# Altium project AT42QT1010_EVK.PrjPcb
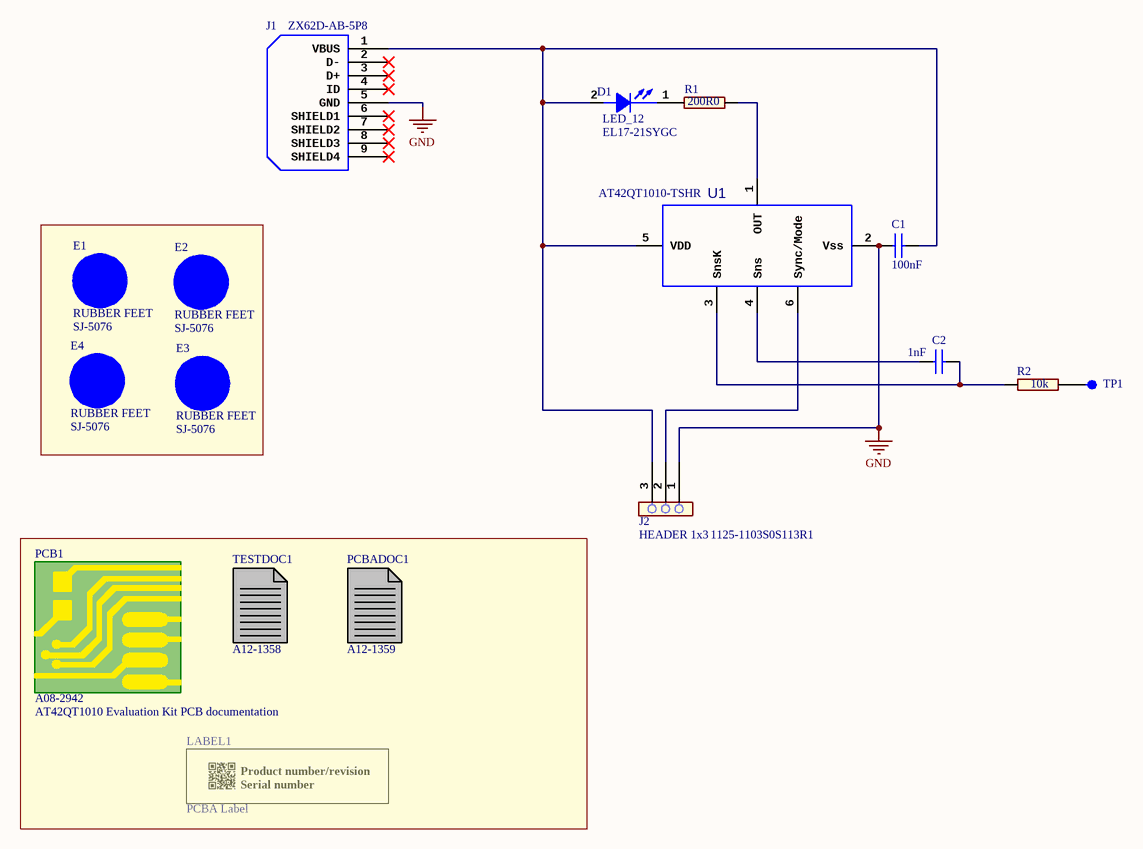
[diagram p0: AT42QT1010_EVK.SchDoc]
1 sheet, 17 parts. Net scope: global (net labels, ports and power ports of the same name join across sheets).
Board file: AT42QT1010_EVK.PcbDoc

## Sheet AT42QT1010_EVK.SchDoc
size A4

### Parts
C1  value 100nF  [AP1-00002]  (hidden comment: CAP-NONPOL)
C2  value 1nF  [AP1-00002]  (hidden comment: CAP-NONPOL)
D1  LED_12  value EL17-21SYGC  [AP4-00013]
E1  RUBBER FEET  value SJ-5076  [AP8-00192]
E2  RUBBER FEET  value SJ-5076  [AP8-00192]
E3  RUBBER FEET  value SJ-5076  [AP8-00192]
E4  RUBBER FEET  value SJ-5076  [AP8-00192]
J1  value ZX62D-AB-5P8  [AP8-00852]  (hidden comment: 2,000 pieces per reel / NOTE! It is recommended to use low-cost version A08-2839 for new designs.)
J2  HEADER 1x3  value 1125-1103S0S113R1  [AP8-01075]
LABEL1  value PCBA Label  [AP8-00317]  (hidden comment: PCBA_LABEL)
PCB1  value AT42QT1010 Evaluation Kit PCB documentation  AN: A08-2942  (hidden comment: PCB)  (mechanical)
PCBADOC1  AN: A12-1359  (hidden comment: PCBADOC)  (mechanical)
R1  value 200R0  [AP2-00001]  (hidden comment: Farnell no: 	2116604)
R2  value 10k  [AP2-00001]  (hidden comment: R2)
TESTDOC1  AN: A12-1358  (hidden comment: TESTDOC)  (mechanical)
TP1  (no value)  [AP8-00010]  (no BOM)
U1  value AT42QT1010-TSHR  [AP6-00056]  (hidden comment: AT42QT1010)

### Nets
GND: C1.1 J1.5(GND) J2.1 U1.2(Vss)
NetC1_2: C1.2 D1.2(ANODE) J1.1(VBUS) J2.3 U1.5(VDD)
NetC2_1: C2.1 U1.4(Sns)
NetC2_2: C2.2 R2.1 U1.3(SnsK)
NetD1_1: D1.1(CATHODE) R1.1
NetJ2_2: J2.2 U1.6(Sync/Mode)
NetR1_2: R1.2 U1.1(OUT)
NetR2_2: R2.2 TP1.1

Not connected (* = marked no-connect by the designer): E1 1(FIDUCIAL); E2 1(FIDUCIAL); E3 1(FIDUCIAL); E4 1(FIDUCIAL); J1 2(D-)* 3(D+)* 4(ID)* 6(SHIELD1)* 7(SHIELD2)* 8(SHIELD3)* 9(SHIELD4)*

### Notes on the sheet
- Drawn By:
- Project Title
- Engineer:
- Designed with
- Sheet Title
- Size
- A4
- PCB Number:
- PCB Assembly Number:
- PCBA Revision:
- PCB    Revision:
- Date:
- Altium.com <http://go.altium.com/MicrochipLandingPage_Evaluation.html>
- File:
- Page:
- (in symbol A09-0611) / Product number/revision / Serial number

### Library data of the parts
C1 = A01-0367: Ceramic capacitor, SMD 0603, X7R, 50V, Â±10 %; PartGroup: Capacitors,Ceramic,SMD 0603; Manufacturer: AVX; MPN: 06035C104KAT2A; ComponentStatus: 'Active (verified)'; Status: Active; Verified by: Lars Helge Mo; Verified date: 2005-12-15; AN: A01-0367; Height: 0.899999976158142; FootprintStatus: 'Active (Verified)'
C2 = A01-0675: Ceramic capacitor, SMD 0603, X7R, 50V, 10 %; PartGroup: Capacitors,Ceramic,SMD 0603; Manufacturer: Multicomp; MPN: MC0603N102J500CT; Tolerance: 10%; TemperatureRange: -55 to +125 deg C; ComponentStatus: 'Active (verified)'; Status: Active; Verified by: Lars Helge Mo; Verified date: 2005-12-15; AN: A01-0675; Height: 0.899999976158142; FootprintStatus: 'Active (Verified)'
D1 = A10-0018: LED, Green, Wave length=575nm, SMD 0805, ±70°; PartGroup: Opto,LEDs,SMD; Manufacturer: Everlight; TemperatureRange: -40 - +85 deg C; ComponentStatus: 'Active (verified)'; Verified date: 2006-02-17; Verified by: Sveinung Helgeland; Status: Active; AN: A10-0018; Height: 1.10000002384186; MPN: EL17-21SYGC; FootprintStatus: 'Active (Verified)'
E1-E4 = A08-0053: 2.8mm adhesive feet,diam 8.0mm; PartGroup: Mechanical devices,Mounting accessories; Manufacturer: 3M; ComponentStatus: 'Active (verified)'; Verified date: 2006-05-05; Verified by: Ketil Skjerve; Status: Active; AN: A08-0053; Height: 2,79999995231628; MPN: SJ-5076; FootprintStatus: 'Active (Verified)'
J1 = A08-2112: Micro USB AB Connector, Standard SMT + DIP; PartGroup: Mechanical devices,Connectors,USB; Manufacturer: HIROSE; MPN: ZX62D-AB-5P8(30); ComponentStatus: 'Active (verified)'; Verified date: 2006-05-18; Verified by: Eirik Rasmussen; Status: Active; AN: A08-2112; Height: 2.79999995231628; FootprintStatus: 'Active (Verified)'
J2 = A08-2783: 1x3 pin header, 2.54mm pitch, Pin-in-Paste THM; PartGroup: Mechanical devices,Connectors,Pin headers; Manufacturer: WCON HARDWARE ELECTRONICS CO., LTD; TemperatureRange: -40Â°C to +105Â°C; ComponentStatus: 'Active (verified)'; Verified date: 2006-01-30; Verified by: Lars Helge Mo; Status: Active; AN: A08-2783; Height: 9; MPN: 1125-1103S0S113R1; FootprintStatus: 'Active (Verified)'
LABEL1 = A09-0611: PCBA identification label PP Top White Gloss; PartGroup: Mechanical devices,Packaging materials,Printed Labels; Manufacturer: ACT Logimark AS; MPN: 505462; ComponentStatus: 'Active (verified)'; Status: New; AN: A09-0611; FootprintStatus: 'Active (Verified)'
PCB1 = A08-2942: AT42QT1010 Evaluation Kit PCB documentation; PartGroup: Mechanical devices,Printed circuit boards; ComponentStatus: 'Active (verified)'
PCBADOC1 = A12-1359: AT42QT1010 Evaluation Kit PCBA documentation; PartGroup: Documentation,PCBA Documents,Atmel; ComponentStatus: 'Active (verified)'; Value: AT42QT1010 Evaluation Kit PCBA documentation
R1 = A02-1114: Thin film resistor, SMD 0603, 166mW, 0.1%, 0603; PartGroup: Resistors,Metal film,SMD Precision resistors; Manufacturer: TE Connectivity; MPN: RP73PF1J200RBTDF; Tolerance: Â±0.1%; TemperatureRange: -55Â°C to +155Â°C; ComponentStatus: 'Active (verified)'; Status: Active; Verified by: Lars Helge Mo; Verified date: 2005-12-19; AN: A02-1114; Height: 0.449999988079071; FootprintStatus: 'Active (Verified)'
R2 = A02-0098: Thick film resistor, SMD 0603, 1/10W, 1%; PartGroup: Resistors,SMD,0603 1%; Manufacturer: KOA; MPN: RK73H1JTTD1002F; ComponentStatus: 'Active (verified)'; Status: Active; Verified by: Lars Helge Mo; Verified date: 2005-12-19; AN: A02-0098; Tolerance: 1 %; Height: 0.5; FootprintStatus: 'Active (Verified)'
TESTDOC1 = A12-1358: AT42QT1010 Evaluation Kit Test Instructions; PartGroup: Documentation,Procedures,Test Instructions; ComponentStatus: 'Active (verified)'; Value: AT42QT1010 Evaluation Kit Test Instructions
TP1 = A08-0004: Single SMD testpad; PartGroup: Mechanical devices,Connectors,Test points; ComponentStatus: 'Active (verified)'; Status: Active; Verified by: Sveinung Helgeland; Verified date: 2006-02-17; AN: A08-0004; Value: TESTPAD; Height: 0; FootprintStatus: 'Active (Verified)'
U1 = A06-0669: 1ch QTouch Sensor IC; PartGroup: Integrated Circuits,Special function,Touch Sense; Manufacturer: ATMEL; ComponentStatus: 'Active (verified)'; Verified date: 2011.05.12; Verified by: vlarsen; Status: Active; AN: A06-0669; Height: 1.45000004768372; MPN: AT42QT1010-TSHR; FootprintStatus: 'Active (Verified)'